# EasyEDA Pro project triple-J UAV 原理图+PCB.epro, board PCB2
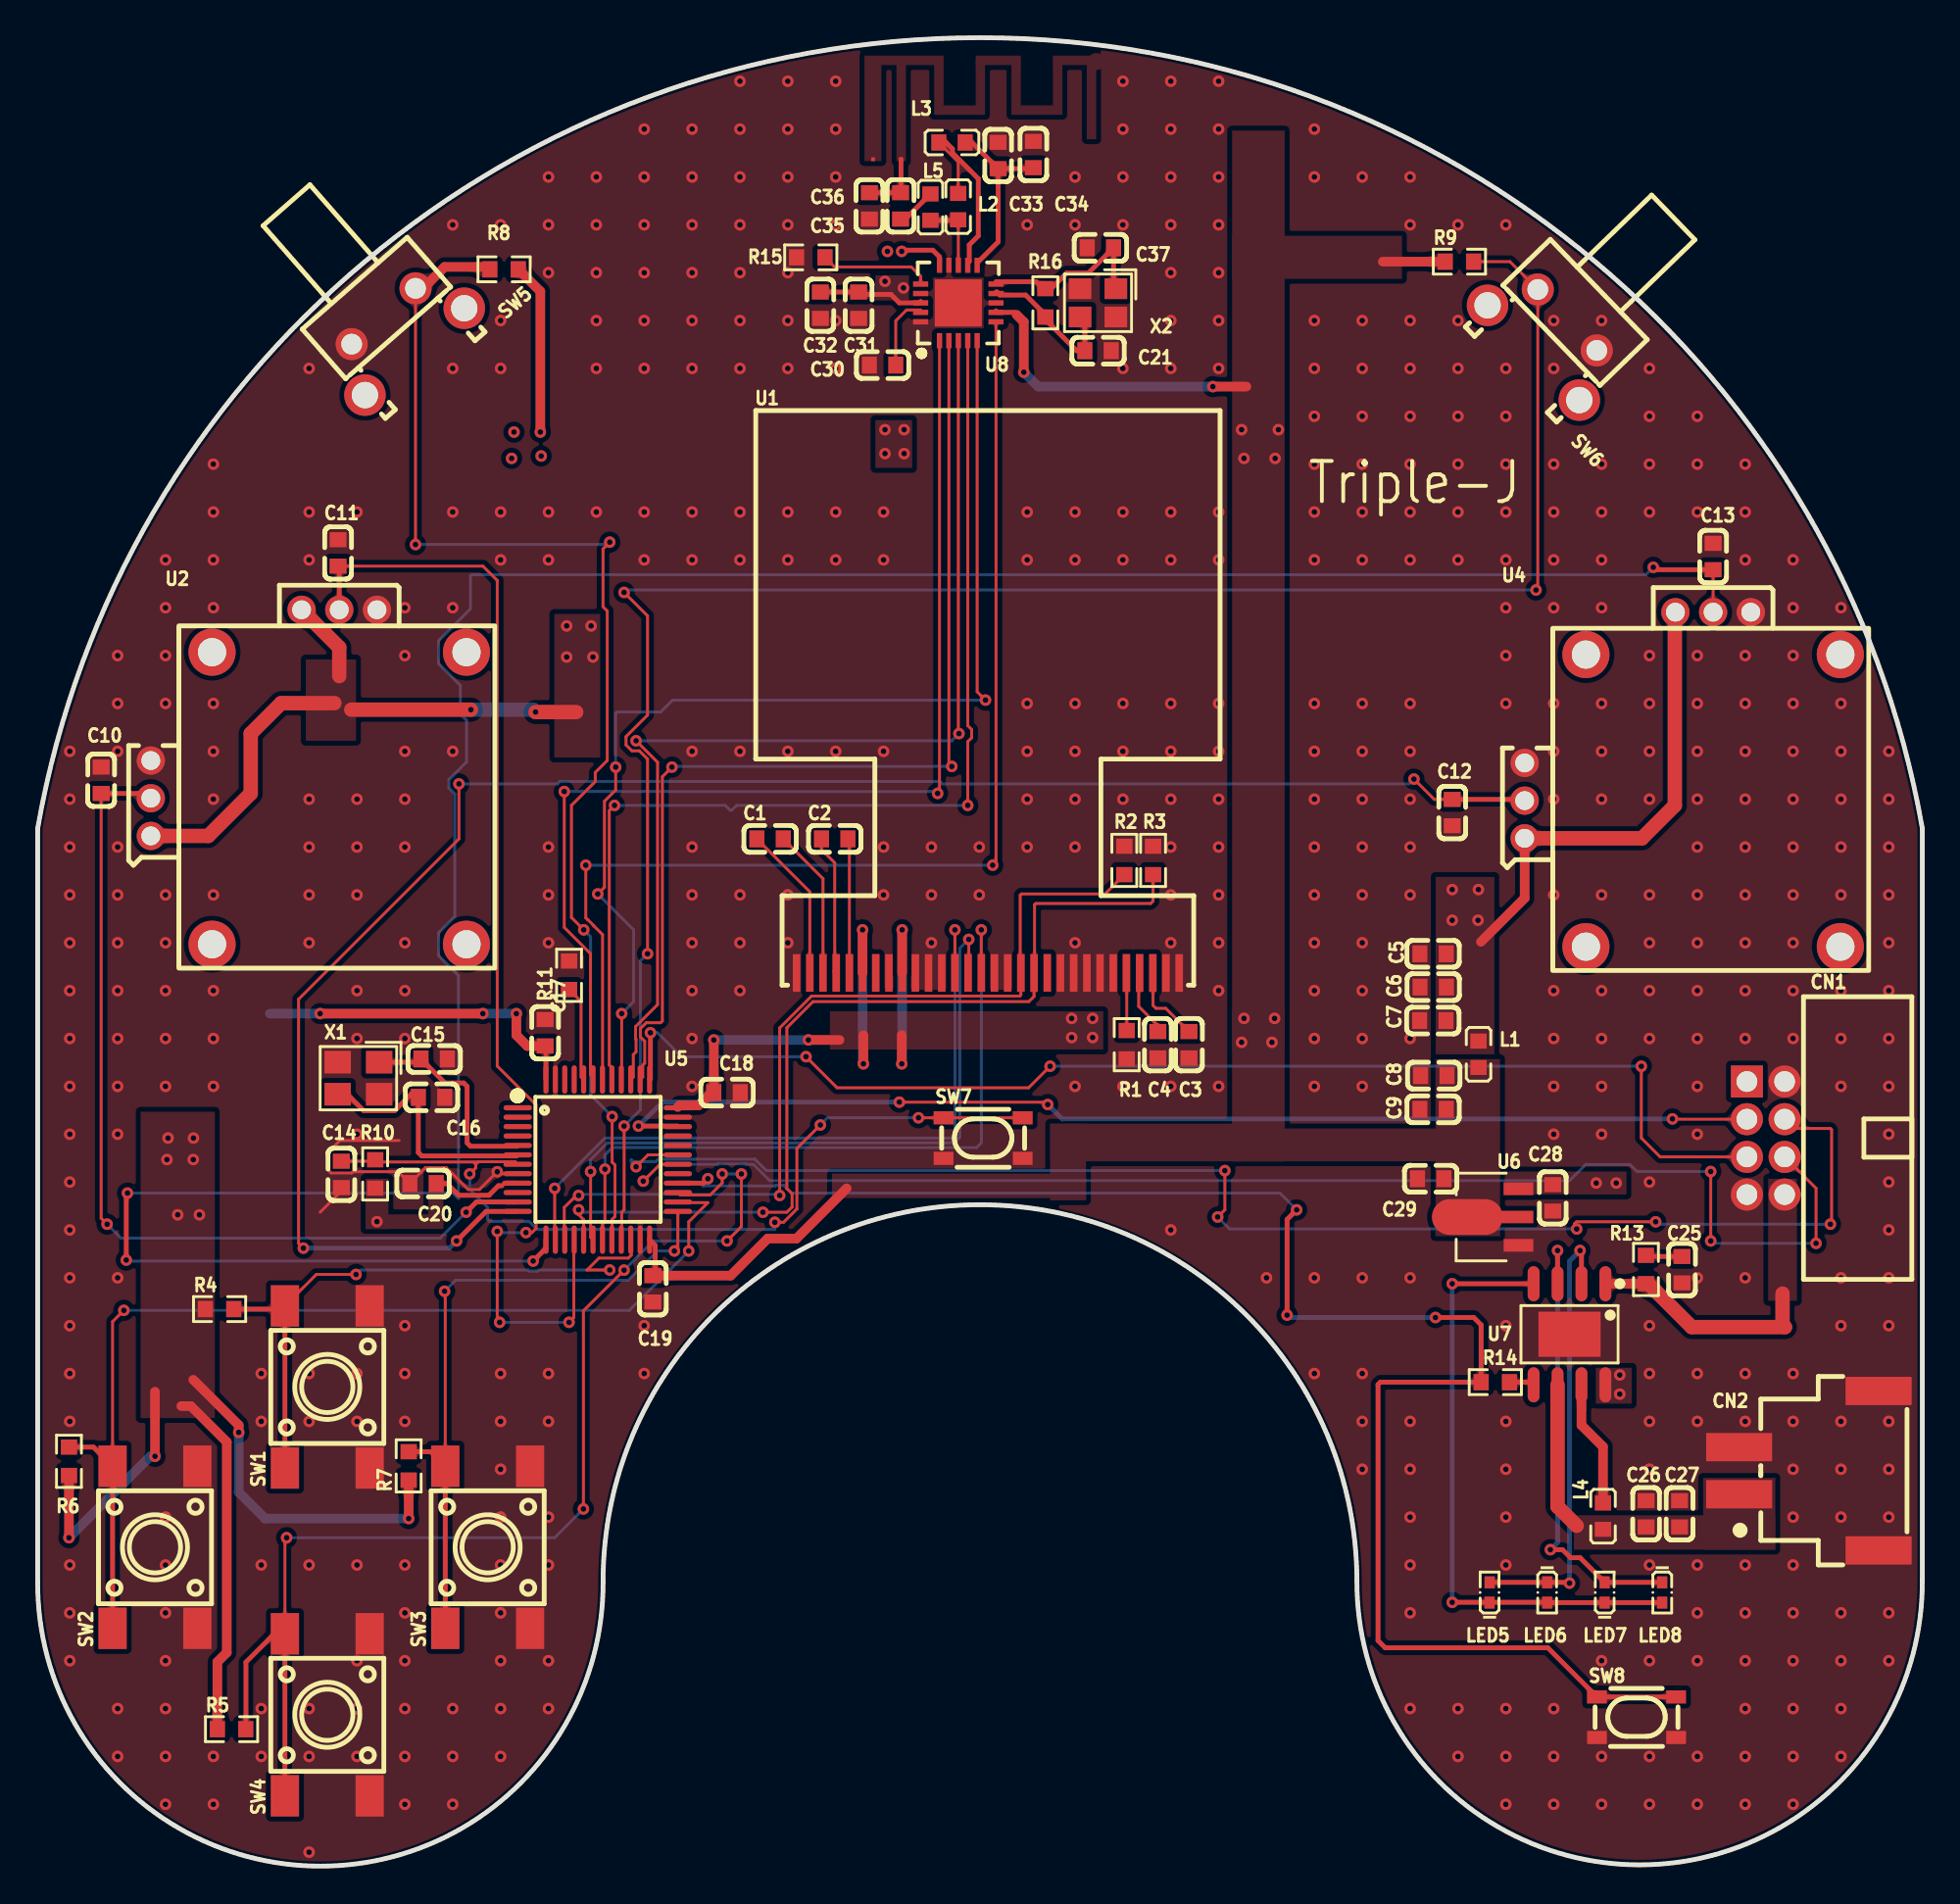
[diagram p11: board, top side]
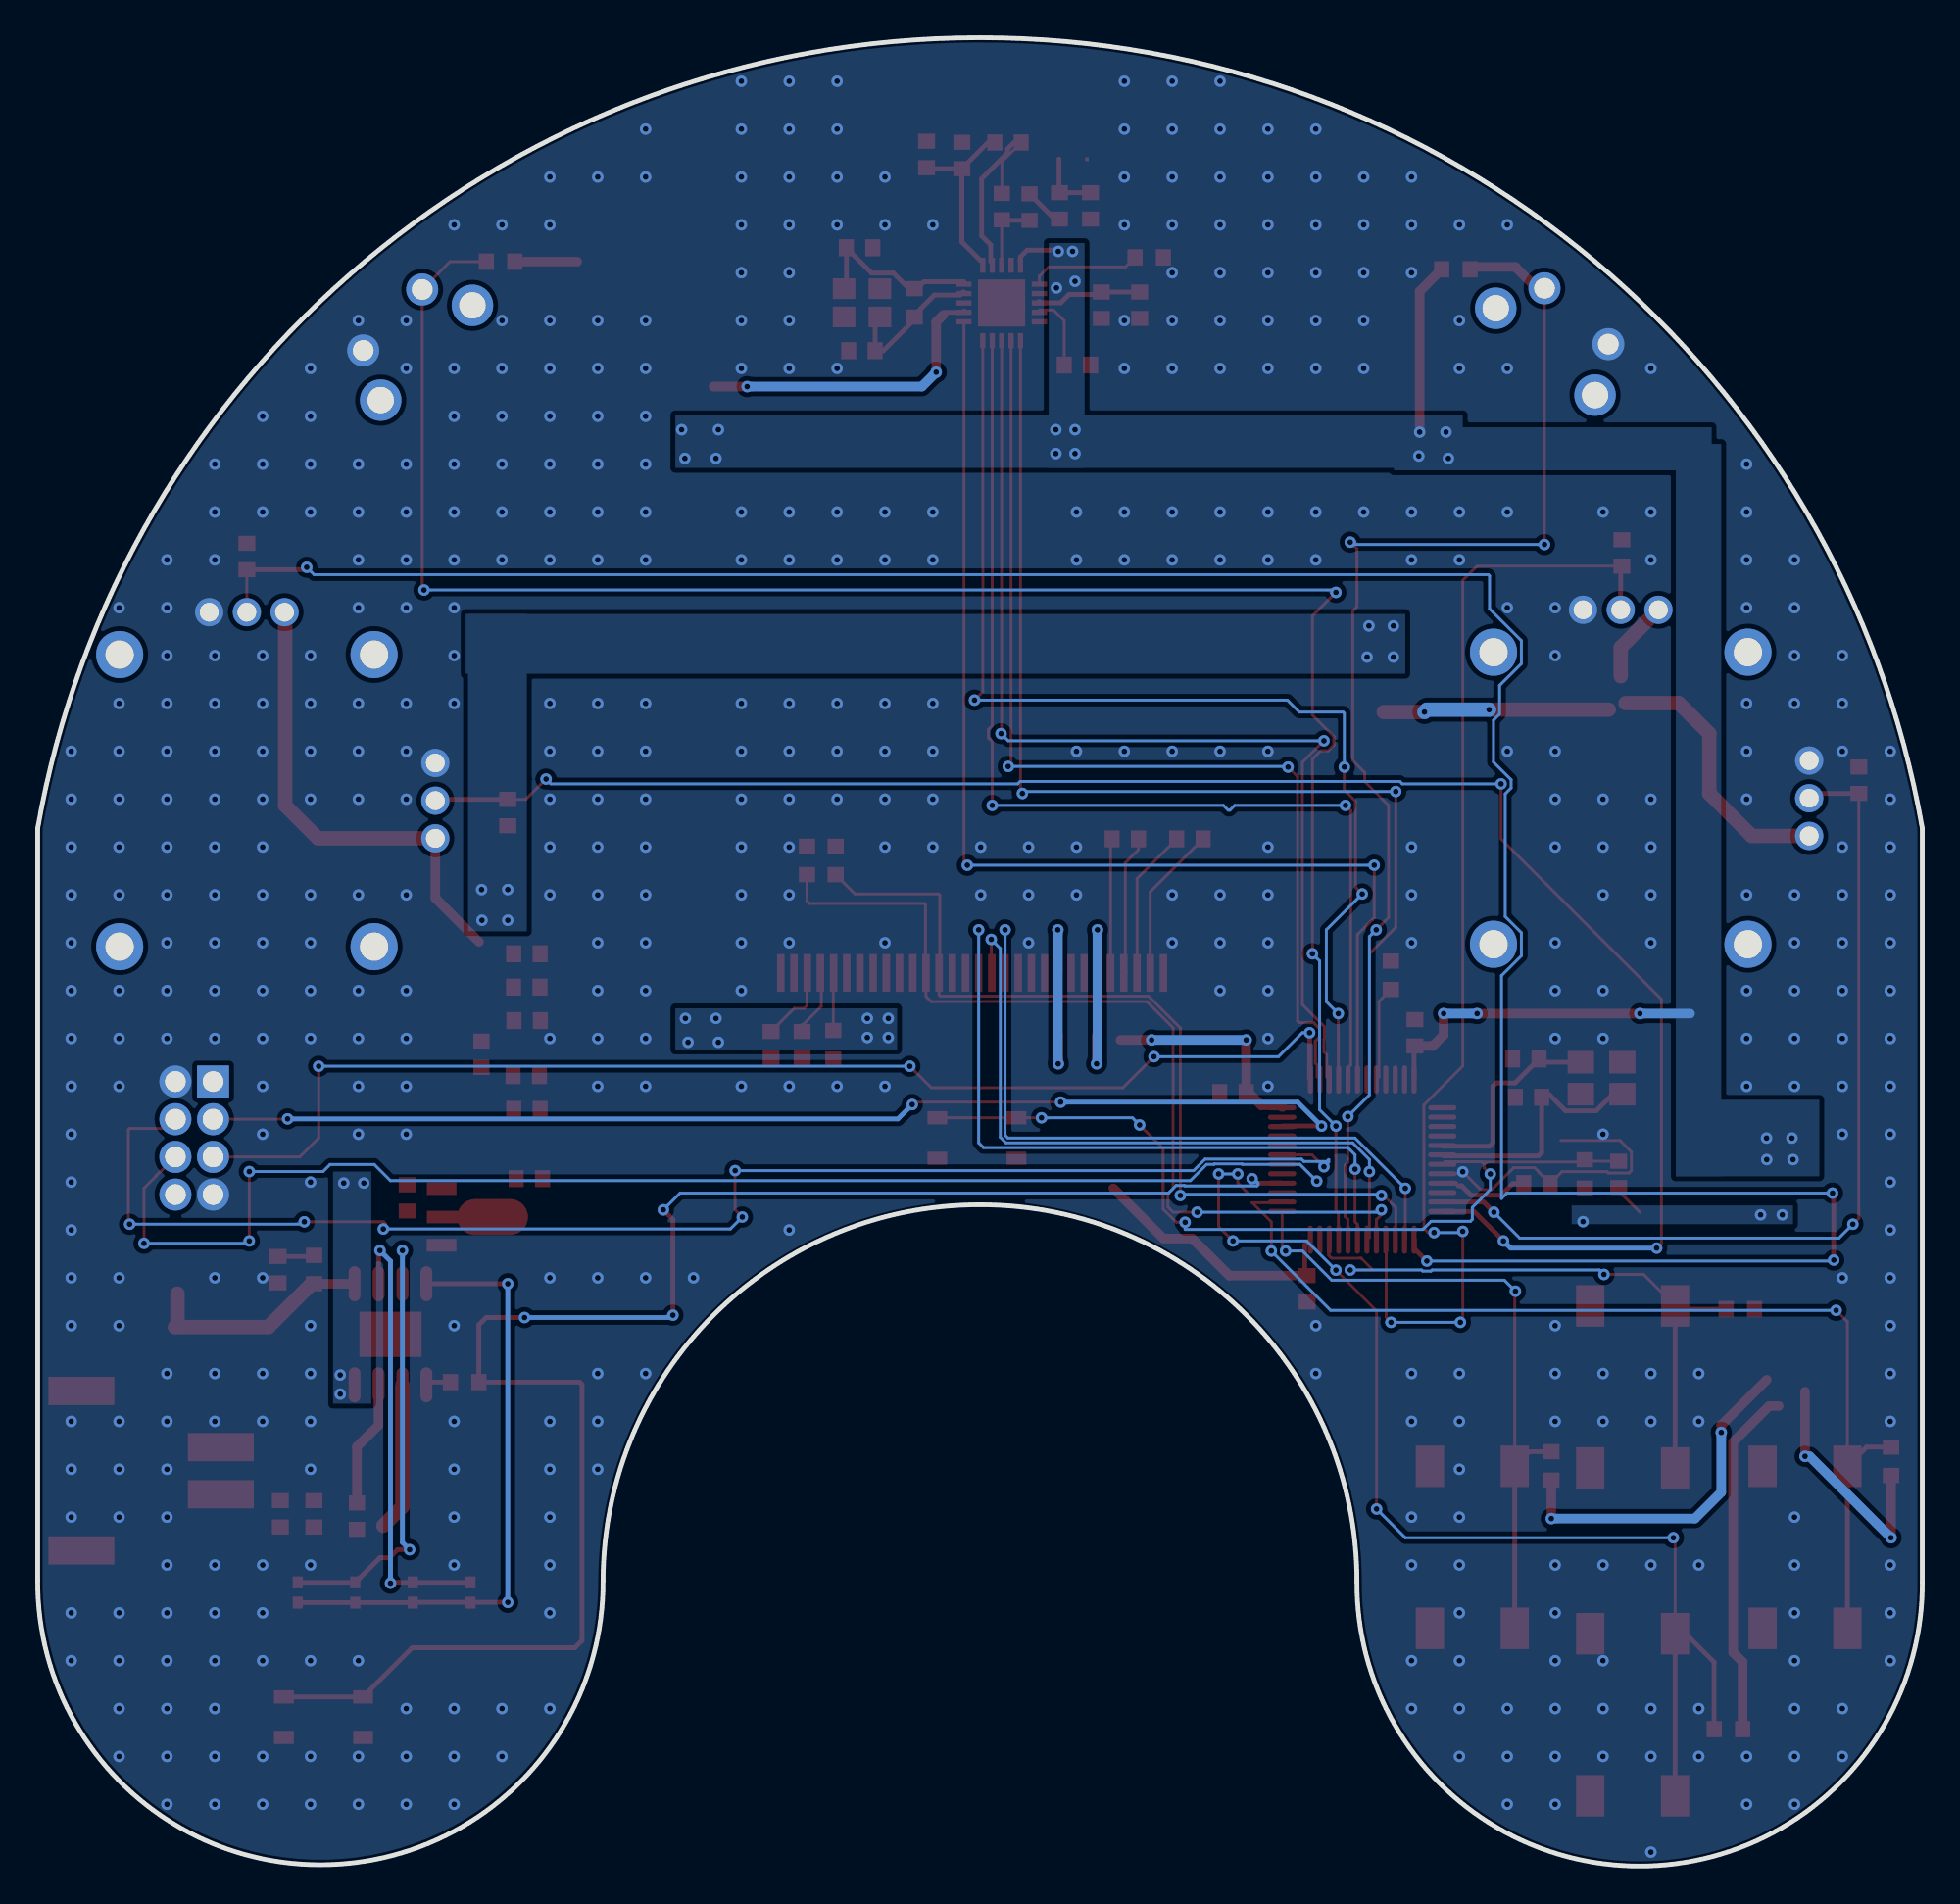
[diagram p12: board, bottom side, seen from below]

Outline 100 x 97.04 mm; copper layers: Top Layer, Bottom Layer. Coordinates in mm from the lower left corner of the outline.
Outline path: 0,55.09 0,15.09 arc(15,0) 30,15.09 arc(50,35.09) 70,15.13 arc(85,0.09) 100,15.17 100,55.09 arc(50,97.04) 0,55.09
Stack: Top Layer 0.035mm / Dielectric1 1.51mm FR4 er 4.5 / Bottom Layer 0.035mm

## Design rules (mm)
template: 自定义配置
spacing copperThickness1oz (default): track to track 0.102, other pairs 0.152 to 0.3
spacing copperThickness2oz: track to track 0.203, other pairs 0.152 to 0.3
track width copperThickness1oz (default): min 0.127, default 0.152, max 2.54
track width copperThickness2oz: min 0.203, default 0.254, max 2.54
differential pair differentialPair (default): width min 0.127, default 0.254, max 2.54; gap min 0.152, default 0.152
via viaSize (default): diameter min 0.5, default 0.61, max 10; hole min 0.3, default 0.305, max 6.3

## Placement (name value [footprint] x y rotation side)
C1  1uF  [C0603]  38.86 54.52 0 top
C2  1uF  [C0603]  42.29 54.52 0 top
C3  2.2uF  [C0603]  61.09 43.6 90 top
C4  4.7uF  [C0603]  59.44 43.6 90 top
C5  10uF  [C0603]  74.04 48.43 0 top
C6  100nF  [C0603]  74.05 46.66 0 top
C7  1nF  [C0603]  74.03 44.88 0 top
C8  100nF  [C0603]  74.08 41.96 0 top
C9  10uF  [C0603]  74.04 40.17 0 top
C10  100nF  [C0603]  3.37 57.64 270 top
C11  100nF  [C0603]  15.94 69.7 90 top
C12  100nF  [C0603]  75.06 55.92 90 top
C13  100nF  [C0603]  88.9 69.51 90 top
C14  100nF  [C0603]  16.11 36.72 90 top
C15  12pF  [C0603]  21.04 42.84 0 top
C16  12pF  [C0603]  20.9 40.81 180 top
C17  100nF  [C0603]  26.92 44.24 270 top
C18  100nF  [C0603]  36.58 41.06 180 top
C19  100nF  [C0603]  32.64 30.65 90 top
C20  100nF  [C0603]  20.45 36.23 0 top
C21  100nF  [C0603]  56.26 80.43 180 top
C25  2.2uF  [C0603]  87.25 31.66 270 top
C26  10uF  [C0603]  85.34 18.71 270 top
C27  10uF  [C0603]  87.12 18.71 270 top
C28  10uF  [C0603]  80.39 35.47 90 top
C29  10uF  [C0603]  73.91 36.49 180 top
C30  33nF  [C0603]  44.83 79.67 0 top
C31  100nF  [C0603]  43.56 82.84 90 top
C32  10nF  [C0603]  41.53 82.84 90 top
C33  2.2nF  [C0603]  50.96 90.79 270 top
C34  4.7pF  [C0603]  52.83 90.84 270 top
C35  1.5pF  [C0603]  45.78 88.12 270 top
C36  1pF  [C0603]  44.13 88.12 270 top
C37  100nF  [C0603]  56.39 85.89 180 top
CN1  3111-08RG0BK00T1  [CONN-TH_3111-08RG0BK00T1]  91.69 38.65 270 top
CN2  ZX-XH2.54-2PWT  [CONN-SMD_2P-P2.54_MEGASTAR_ZX-XH2.54-2PWT]  93.98 20.99 90 top
L1  10uH  [L0603]  76.45 43.09 270 top
L2  8.2nH  [L0603]  48.84 88.08 270 top
L3  2.7nH  [L0603]  48.51 91.48 0 top
L4  1.5uH  [L0603]  83.06 18.58 270 top
L5  3.9nH  [L0603]  47.37 88.05 90 top
LED5  XL-1005UYC  [LED0402-FD_YELLOW]  77.04 14.53 270 top
LED6  XL-1005UYC  [LED0402-FD_YELLOW]  80.09 14.53 90 top
LED7  XL-1005UYC  [LED0402-FD_YELLOW]  83.15 14.53 270 top
LED8  XL-1005UYC  [LED0402-FD_YELLOW]  86.2 14.53 90 top
NOREF  -  [Pad_e295]  45.81 90.59 90 top
NOREF#2  -  [Pad_e296]  44.33 90.59 90 top
R1  910  [R0603]  57.78 43.6 90 top
R2  10K  [R0603]  57.66 53.38 270 top
R3  10K  [R0603]  59.18 53.38 270 top
R4  10K  [R0603]  9.65 29.57 0 top
R5  10K  [R0603]  10.29 7.28 0 top
R6  10K  [R0603]  1.66 21.49 90 top
R7  10K  [R0603]  19.69 21.25 90 top
R8  10K  [R0603]  24.75 84.75 180 top
R9  10K  [R0603]  75.44 85.16 0 top
R10  10K  [R0603]  17.91 36.74 270 top
R11  10K  [R0603]  28.19 47.28 90 top
R13  1.5  [R0603]  85.34 31.67 90 top
R14  10K  [R0603]  77.34 25.69 180 top
R15  10K  [R0603]  41.02 85.38 180 top
R16  10K  [R0603]  53.47 82.97 90 top
SW1  TS-1102S-C-M-B  [KEY-SMD_4P-L6.0-W6.0-P4.50-LS8.6_TS-1102S-C-M-B]  15.37 25.44 90 top
SW2  TS-1102S-C-M-B  [KEY-SMD_4P-L6.0-W6.0-P4.50-LS8.6_TS-1102S-C-M-B]  6.22 16.93 90 top
SW3  TS-1102S-C-M-B  [KEY-SMD_4P-L6.0-W6.0-P4.50-LS8.6_TS-1102S-C-M-B]  23.88 16.93 90 top
SW4  TS-1102S-C-M-B  [KEY-SMD_4P-L6.0-W6.0-P4.50-LS8.6_TS-1102S-C-M-B]  15.37 8.04 90 top
SW5  UK-B02124G90-AQ25Y  [SW-TH_UK-B02124G90-AQ25Y]  19.18 81.32 221.2 top
SW6  UK-B02124G90-AQ25Y  [SW-TH_UK-B02124G90-AQ25Y]  80.26 81.19 134.1 top
SW7  SKRPACE010  [KEY-SMD_4P-L4.2-W3.2-P2.20-LS4.6]  50.16 38.65 0 top
SW8  SKRPACE010  [KEY-SMD_4P-L4.2-W3.2-P2.20-LS4.6]  84.84 7.91 0 top
U1  X096-2864KSWPG01-H30  [OLED-SMD_X096-2864KSWPG01-H30]  50.42 47.41 0 top
U2  -  [1616]  16 56.68 0 top
U4  -  [1616]  88.9 56.55 0 top
U5  STM32F103C8T6  [LQFP-48_L7.0-W7.0-P0.50-LS9.0-BL]  29.72 37.5 270 top
U6  AMS1117-3.3VSOT-89  [SOT-89-3_L4.5-W2.5-P1.50-LS4.2-BR]  77.22 34.46 0 top
U7  TP4336  [ESOP-8_L4.9-W3.9-P1.27-LS6.0-BL-EP-1]  81.28 28.23 180 top
U8  Si24R1  [QFN-20_L4.0-W4.0-P0.50-BL-EP]  48.85 82.96 0 top
X1  8MHz  [CRYSTAL-SMD_4P-L3.2-W2.5-BL]  17.02 41.82 180 top
X2  16MHz  [CRYSTAL-SMD_4P-L2.5-W2.0-BL-2]  56.26 82.97 180 top

## Footprints (pads in the part's own frame, mm; a bottom-side part is the same pattern mirrored in y, then rotated)
1616
  round 1.5 hole 1: 1(-10,2) 2(-10,0) 3(-10,-2.001) 4(-2,10) 5(0,10) 6(2,10)
  round 2.5 hole 1.5: 7(-6.75,-7.75) 8(6.75,-7.75) 9(6.75,7.75) 10(-6.75,7.75)
C0603
  rect 0.8x0.9 smd: 1(-0.7,0) 2(0.7,0)
CONN-SMD_2P-P2.54_MEGASTAR_ZX-XH2.54-2PWT
  rect 1.5x3.5 smd: 1(-1.25,3.7) 2(1.25,3.7) 3(-4.23,-3.7) 4(4.23,-3.7)
CONN-TH_3111-08RG0BK00T1
  rect 1.7x1.7 hole 1.1: 1(-3,-1)
  round 1.7 hole 1.1: 2(-3,1) 3(-1,-1) 4(-1,1) 5(1,-1) 6(1,1) 7(3,-1) 8(3,1)
CRYSTAL-SMD_4P-L2.5-W2.0-BL-2
  rect 1.2x1.1 smd: 1(-0.95,-0.75) 2(0.95,-0.75) 3(0.95,0.75) 4(-0.95,0.75)
CRYSTAL-SMD_4P-L3.2-W2.5-BL
  rect 1.4x1.2 smd: 1(-1.1,-0.85) 2(1.1,-0.85) 3(1.1,0.85) 4(-1.1,0.85)
ESOP-8_L4.9-W3.9-P1.27-LS6.0-BL-EP-1
  oval 0.63x1.865 smd: 1(-1.905,-2.683) 2(-0.635,-2.683) 3(0.635,-2.683) 4(1.905,-2.683) 5(1.905,2.683) 6(0.635,2.683) 7(-0.635,2.683) 8(-1.905,2.683)
  rect 3.3x2.4 smd: 9(0,0)
KEY-SMD_4P-L4.2-W3.2-P2.20-LS4.6
  rect 1.05x0.7 smd: 1(-2.1,1.075) 2(2.1,1.075) 3(-2.1,-1.075) 4(2.1,-1.075)
KEY-SMD_4P-L6.0-W6.0-P4.50-LS8.6_TS-1102S-C-M-B
  rect 2.2x1.5 smd: 1(-4.3,2.25) 2(4.3,2.25) 3(-4.3,-2.25) 4(4.3,-2.25)
L0603
  rect 0.8x0.864 smd: 1(-0.7,0) 2(0.7,0)
LED0402-FD_YELLOW
  rect 0.636x0.54 smd: 1(-0.538,0) 2(0.538,0)
LQFP-48_L7.0-W7.0-P0.50-LS9.0-BL
  oval 0.27x1.5 smd: 1(-2.75,-4.25) 2(-2.25,-4.25) 3(-1.75,-4.25) 4(-1.25,-4.25) 5(-0.75,-4.25) 6(-0.25,-4.25) 7(0.25,-4.25) 8(0.75,-4.25) 9(1.25,-4.25) 10(1.75,-4.25) 11(2.25,-4.25) 12(2.75,-4.25) 25(2.75,4.25) 26(2.25,4.25) 27(1.75,4.25) 28(1.25,4.25) 29(0.75,4.25) 30(0.25,4.25) 31(-0.25,4.25) 32(-0.75,4.25) 33(-1.25,4.25) 34(-1.75,4.25) 35(-2.25,4.25) 36(-2.75,4.25)
  oval 1.5x0.27 smd: 13(4.25,-2.75) 14(4.25,-2.25) 15(4.25,-1.75) 16(4.25,-1.25) 17(4.25,-0.75) 18(4.25,-0.25) 19(4.25,0.25) 20(4.25,0.75) 21(4.25,1.25) 22(4.25,1.75) 23(4.25,2.25) 24(4.25,2.75) 37(-4.25,2.75) 38(-4.25,2.25) 39(-4.25,1.75) 40(-4.25,1.25) 41(-4.25,0.75) 42(-4.25,0.25) 43(-4.25,-0.25) 44(-4.25,-0.75) 45(-4.25,-1.25) 46(-4.25,-1.75) 47(-4.25,-2.25) 48(-4.25,-2.75)
OLED-SMD_X096-2864KSWPG01-H30
  rect 0.4x2 smd: 1(-10.15,0) 2(-9.45,0) 3(-8.75,0) 4(-8.05,0) 5(-7.35,0) 6(-6.65,0) 7(-5.95,0) 8(-5.25,0) 9(-4.55,0) 10(-3.85,0) 11(-3.15,0) 12(-2.45,0) 13(-1.75,0) 14(-1.05,0) 15(-0.35,0) 16(0.35,0) 17(1.05,0) 18(1.75,0) 19(2.45,0) 20(3.15,0) 21(3.85,0) 22(4.55,0) 23(5.25,0) 24(5.95,0) 25(6.65,0) 26(7.35,0) 27(8.05,0) 28(8.75,0) 29(9.45,0) 30(10.15,0)
Pad_e295
  rect 0.2x0.2 smd: 1(0,0)
Pad_e296
  rect 0.2x0.2 smd: 2(0,0)
QFN-20_L4.0-W4.0-P0.50-BL-EP
  rect 0.28x0.8 smd: 1(-1,-2) 2(-0.5,-2) 3(0,-2) 4(0.5,-2) 5(1,-2) 11(1,2) 12(0.5,2) 13(0,2) 14(-0.5,2) 15(-1,2)
  rect 0.8x0.28 smd: 6(2,-1) 7(2,-0.5) 8(2,0) 9(2,0.5) 10(2,1) 16(-2,1) 17(-2,0.5) 18(-2,0) 19(-2,-0.5) 20(-2,-1)
  rect 2.5x2.5 smd: 21(0,0)
R0603
  rect 0.806x0.864 smd: 1(-0.753,0) 2(0.753,0)
SOT-89-3_L4.5-W2.5-P1.50-LS4.2-BR
  rect 1.575x0.672 smd: 1(1.356,-1.5) 3(1.356,1.5)
  custom 5.377x1.9 smd: 2(-1.356,0)
SW-TH_UK-B02124G90-AQ25Y
  round 1.7 hole 1.1: 1(-2.25,-1.25) 2(2.25,-1.25)
  round 2.2 hole 1.4: 3(-3.5,1.25) 4(3.5,1.25)

## Nets
As in the schematic, except:
AT1: C35.1 C36.1 NOREF.1 NOREF#2.2
$4N1175: R11.1 U5.44

Pads without a net: CN1 1; SW5 3 4; SW6 3 4; U1 7 20; U2 7 8 9 10; U4 7 8 9 10; U5 1 2 3 4 10 29 32 33 45 46

## Via types
v1: diameter 0.61, hole 0.305, Top Layer to Bottom Layer, 673 vias

## Routing (per net, layer and track width the routed paths; a pad name or vN(x,y) marks a point on that pad's centre or on a via; arc(x,y) is an arc through that point)
3V3: length 157.5
  Top Layer w0.254: 32.77,31.47 32.77,32.96 U5.24 ; C20.2 21.72,36.23 22.34,35.61 23.94,35.61 24.45,36.12 24.63,36.12 ; 47.85,85.09 47.85,85.41 47.5,85.76 45.91,85.76 v1(45.84,85.7) ; 46.85,83.05 46.77,82.97 45.72,82.97 45.27,83.42 43.69,83.42 43.56,83.54 41.53,83.54 ; U5.9 24.77,36.25 ; 51.94,82.34 51.81,82.47 50.93,82.47 50.85,82.55 ; U5.48 26.97,43.49 C17.2
  Top Layer w0.508: 8.25,25.82 10.67,23.41 v1(10.67,23.03) ; R5.1 9.53,10.84 10.03,11.34 10.03,22.52 8.13,24.42 7.62,24.42 ; R6.1 v1(1.66,17.44) ; v1(52.32,79.29) 52.32,81.95 51.94,82.34 ; v1(45.85,42.58) 45.85,44.11 ; R9.1 71.37,85.16 ; v1(25.4,45.25) 25.4,44.11 25.97,43.54 C17.2 ; v1(40.89,43.85) 42.54,43.85 ; U1.9 v1(45.87,49.7) ; R7.1 v1(19.69,18.45) ; R8.1 26.67,83.58 v1(26.67,76.11) ; U1.6 v1(43.77,49.7) ; v1(35.88,43.85) C18.2 35.75,41.06 35.07,40.38 34.05,40.38 33.97,40.3 ; v1(43.81,42.58) 43.81,44.11 ; 42.93,35.98 40.26,33.31 38.74,33.31 36.77,31.35 C19.2 ; v1(6.22,21.76) 6.22,25.19 ; v1(23.62,45.25) v1(14.99,45.25) ; v1(62.36,78.53) 64.13,78.53
  Bottom Layer w0.508: v1(25.4,45.25) v1(23.62,45.25) ; v1(1.66,17.44) 5.98,21.76 v1(6.22,21.76) ; v1(35.88,43.85) v1(40.89,43.85) ; v1(45.87,49.7) 45.87,42.61 v1(45.85,42.58) ; v1(52.32,79.29) 53.09,78.53 v1(62.36,78.53) ; v1(43.77,49.7) 43.77,42.63 v1(43.81,42.58) ; v1(14.99,45.25) 12.32,45.25 ; v1(10.67,23.03) 10.67,19.85 12.06,18.45 v1(19.69,18.45)
  vias: v1(6.92,38.65) v1(6.86,37.5) v1(7.43,34.57) v1(8.26,38.65) v1(8.25,37.5) v1(8.58,34.57) v1(18,34.21) v1(25.15,74.72) v1(25.27,76.11) v1(26.72,74.84) v1(44.96,84.11) v1(44.96,76.24) v1(44.96,74.97) v1(45.09,85.7) v1(45.94,83.76) v1(45.97,76.24) v1(45.97,74.97) v1(54.86,45) v1(54.86,43.98) v1(55.98,45) v1(55.98,43.98) v1(63.88,76.24) v1(63.88,43.73) v1(64.01,74.72) v1(64.01,45) v1(65.49,43.73) v1(65.63,45) v1(65.66,74.72) v1(65.83,76.24)
3V3A: length 56.3
  Top Layer w0.508: U4.3 78.9,51.38 76.58,49.06
  Top Layer w0.762: 16,63.16 16,64.68 U2.4 ; 15.75,61.73 12.92,61.73 11.3,60.11 11.3,56.94 9.05,54.68 U2.3 ; U4.3 85.12,54.55 86.87,56.3 86.87,66.52 U4.4 ; 16.64,61.38 v1(22.99,61.38) ; v1(26.42,61.25) 28.57,61.25
  Bottom Layer w0.762: v1(22.99,61.38) 26.29,61.38 v1(26.42,61.25)
  vias: v1(28.07,65.83) v1(28.07,64.17) v1(29.36,65.83) v1(29.46,64.17) v1(75.06,51.83) v1(75.06,50.2) v1(76.45,51.83) v1(76.42,50.2)
+5V:
  vias: v1(82.7,36.26) v1(83.76,36.26) v1(83.95,26.07) v1(83.95,25.06)
GND: length 18.4
  Top Layer w0.152: 19.18,38.52 16.04,38.52 15.43,37.91 15.43,36.92 15.57,36.79 16.66,36.79 16.73,36.86 19.12,36.86 C20.1 20.35,36.84 20.35,36.85 20.57,37.07 21.68,37.07 22.84,35.92 23.44,35.92 v1(24.38,36.86) 24.49,36.75 U5.8 ; C14.1 16.11,35.84 14.99,34.71
  vias: v1(1.7,59.17) v1(1.7,56.63) v1(1.7,54.09) v1(1.7,51.55) v1(1.7,49.01) v1(1.7,46.47) v1(1.7,43.93) v1(1.7,41.39) v1(1.7,38.85) v1(1.7,36.31) v1(1.7,33.77) v1(1.7,31.23) v1(1.7,28.69) v1(1.7,26.15) v1(1.7,23.61) v1(1.7,15.99) v1(1.7,13.45) v1(1.7,10.91) v1(4.24,64.25) v1(4.24,61.71) v1(4.24,59.17) v1(4.24,54.09) v1(4.24,51.55) v1(4.24,49.01) v1(4.24,46.47) v1(4.24,43.93) v1(4.24,41.39) v1(4.24,38.85) v1(4.24,31.23) v1(4.24,8.37) v1(4.24,5.83) v1(6.78,69.33) v1(6.78,66.79) v1(6.78,64.25) v1(6.78,61.71) v1(6.78,51.55) v1(6.78,49.01) v1(6.78,46.47) v1(6.78,43.93) v1(6.78,41.39) v1(6.78,18.53) v1(6.78,15.99) v1(6.78,13.45) v1(6.78,10.91) v1(6.78,8.37) v1(6.78,5.83) v1(6.78,3.29) v1(9.32,74.41) v1(9.32,71.87) v1(9.32,69.33) v1(9.32,66.79) v1(9.32,61.71) v1(9.32,59.17) v1(9.32,56.63) v1(9.32,51.55) v1(9.32,46.47) v1(9.32,43.93) v1(9.32,41.39) v1(9.32,5.83) v1(9.32,3.29) v1(11.86,26.15) v1(11.86,23.61) v1(11.86,15.99) v1(11.86,8.37) v1(11.86,5.83) v1(14.4,79.49) v1(14.4,71.87) v1(14.4,69.33) v1(14.4,56.63) v1(14.4,54.09) v1(14.4,51.55) v1(14.4,49.01) v1(14.4,26.15) v1(14.4,23.61) v1(14.4,15.99) v1(14.4,8.37) v1(14.4,5.83) v1(14.4,0.75) v1(16.94,71.87) v1(16.94,56.63) v1(16.94,54.09) v1(16.94,51.55) v1(16.94,46.47) v1(16.94,43.93) v1(16.94,38.85) v1(16.94,26.15) v1(16.94,23.61) v1(16.94,15.99) v1(16.94,10.91) v1(16.94,8.37) v1(16.94,5.83) v1(19.48,66.79) v1(19.48,64.25) v1(19.48,59.17) v1(19.48,56.63) v1(19.48,54.09) v1(19.48,49.01) v1(19.48,46.47) v1(19.48,43.93) v1(19.48,28.69) v1(19.48,26.15) v1(19.48,23.61) v1(19.48,15.99) v1(19.48,13.45) v1(19.48,10.91) v1(19.48,8.37) v1(19.48,5.83) v1(19.48,3.29) v1(22.02,87.11) v1(22.02,79.49) v1(22.02,71.87) v1(22.02,66.79) v1(22.02,59.17) v1(22.02,8.37) v1(22.02,5.83) v1(22.02,3.29) v1(24.56,87.11) v1(24.56,82.03) v1(24.56,79.49) v1(24.56,71.87) v1(24.56,69.33) v1(24.56,26.15) v1(24.56,23.61) v1(24.56,21.07) v1(24.56,18.53) v1(24.56,15.99) v1(24.56,13.45) v1(24.56,10.91) v1(24.56,8.37) v1(24.56,5.83) v1(27.1,89.65) v1(27.1,87.11) v1(27.1,84.57) v1(27.1,71.87) v1(27.1,69.33) v1(27.1,54.09) v1(27.1,51.55) v1(27.1,49.01) v1(27.1,26.15) v1(27.1,23.61) v1(27.1,18.53) v1(27.1,15.99) v1(27.1,10.91) v1(27.1,8.37) v1(29.64,89.65) v1(29.64,87.11) v1(29.64,84.57) v1(29.64,82.03) v1(29.64,79.49) v1(29.64,71.87) v1(32.18,92.19) v1(32.18,89.65) v1(32.18,87.11) v1(32.18,84.57) v1(32.18,82.03) v1(32.18,79.49) v1(32.18,71.87) v1(32.18,69.33) v1(32.18,28.69) v1(32.18,26.15) v1(34.72,92.19) v1(34.72,89.65) v1(34.72,87.11) v1(34.72,84.57) v1(34.72,82.03) v1(34.72,79.49) v1(34.72,71.87) v1(34.72,69.33) v1(34.72,59.17) v1(34.72,54.09) v1(34.72,51.55) v1(34.72,49.01) v1(34.72,46.47) v1(34.72,43.93) v1(34.72,41.39) v1(37.26,94.73) v1(37.26,92.19) v1(37.26,89.65) v1(37.26,87.11) v1(37.26,84.57) v1(37.26,82.03) v1(37.26,79.49) v1(37.26,71.87) v1(37.26,69.33) v1(37.26,59.17) v1(37.26,51.55) v1(37.26,49.01) v1(37.26,46.47) v1(39.8,94.73) v1(39.8,92.19) v1(39.8,89.65) v1(39.8,87.11) v1(39.8,84.57) v1(39.8,82.03) v1(39.8,79.49) v1(39.8,71.87) v1(39.8,69.33) v1(39.8,59.17) v1(39.8,51.55) v1(39.8,49.01) v1(42.34,94.73) v1(42.34,92.19) v1(42.34,89.65) v1(42.34,87.11) v1(42.34,82.03) v1(42.34,79.49) v1(42.34,71.87) v1(42.34,69.33) v1(42.34,59.17) v1(44.88,71.87) v1(44.88,69.33) v1(44.88,59.17) v1(44.88,54.09) v1(44.88,51.55) v1(47.42,54.09) v1(47.42,51.55) v1(47.42,49.01) v1(49.96,54.09) v1(49.96,51.55) v1(52.5,87.11) v1(52.5,71.87) v1(52.5,69.33) v1(52.5,61.71) v1(52.5,59.17) v1(52.5,56.63) v1(52.5,54.09) v1(55.04,89.65) v1(55.04,87.11) v1(55.04,71.87) v1(55.04,69.33) v1(55.04,61.71) v1(55.04,59.17) v1(55.04,56.63) v1(55.04,54.09) v1(55.04,49.01) v1(55.04,41.39) v1(57.58,94.73) v1(57.58,92.19) v1(57.58,89.65) v1(57.58,87.11) v1(57.58,79.49) v1(57.58,71.87) v1(57.58,69.33) v1(57.58,61.71) v1(57.58,59.17) v1(57.58,56.63) v1(57.58,41.39) v1(60.12,94.73) v1(60.12,92.19) v1(60.12,89.65) v1(60.12,87.11) v1(60.12,84.57) v1(60.12,82.03) v1(60.12,79.49) v1(60.12,71.87) v1(60.12,69.33) v1(60.12,61.71) v1(60.12,59.17) v1(60.12,56.63) v1(60.12,54.09) v1(60.12,51.55) v1(60.12,49.01) v1(60.12,41.39) v1(60.12,33.77) v1(62.66,94.73) v1(62.66,92.19) v1(62.66,89.65) v1(62.66,87.11) v1(62.66,84.57) v1(62.66,82.03) v1(62.66,79.49) v1(62.66,71.87) v1(62.66,69.33) v1(62.66,61.71) v1(62.66,59.17) v1(62.66,56.63) v1(62.66,54.09) v1(62.66,51.55) v1(62.66,49.01) v1(62.66,46.47) v1(62.66,41.39) v1(65.2,31.23) v1(67.74,92.19) v1(67.74,89.65) v1(67.74,82.03) v1(67.74,79.49) v1(67.74,76.95) v1(67.74,74.41) v1(67.74,71.87) v1(67.74,69.33) v1(67.74,61.71) v1(67.74,59.17) v1(67.74,56.63) v1(67.74,54.09) v1(67.74,51.55) v1(67.74,49.01) v1(67.74,46.47) v1(67.74,43.93) v1(67.74,41.39) v1(67.74,31.23) v1(67.74,26.15) v1(70.28,89.65) v1(70.28,82.03) v1(70.28,79.49) v1(70.28,76.95) v1(70.28,74.41) v1(70.28,71.87) v1(70.28,69.33) v1(70.28,61.71) v1(70.28,59.17) v1(70.28,56.63) v1(70.28,54.09) v1(70.28,51.55) v1(70.28,49.01) v1(70.28,46.47) v1(70.28,43.93) v1(70.28,41.39) v1(70.28,31.23) v1(70.28,26.15) v1(70.28,23.61) v1(70.28,21.07) v1(72.82,89.65) v1(72.82,87.11) v1(72.82,82.03) v1(72.82,79.49) v1(72.82,76.95) v1(72.82,74.41) v1(72.82,71.87) v1(72.82,69.33) v1(72.82,61.71) v1(72.82,59.17) v1(72.82,56.63) v1(72.82,54.09) v1(72.82,51.55) v1(72.82,43.93) v1(72.82,31.23) v1(72.82,23.61) v1(72.82,21.07) v1(72.82,18.53) v1(72.82,15.99) v1(72.82,13.45) v1(72.82,8.37) v1(75.36,87.11) v1(75.36,82.03) v1(75.36,79.49) v1(75.36,76.95) v1(75.36,74.41) v1(75.36,71.87) v1(75.36,69.33) v1(75.36,8.37) v1(75.36,5.83) v1(77.9,87.11) v1(77.9,79.49) v1(77.9,76.95) v1(77.9,74.41) v1(77.9,71.87) v1(77.9,69.33) v1(77.9,66.79) v1(77.9,64.25) v1(77.9,61.71) v1(77.9,28.69) v1(77.9,23.61) v1(77.9,21.07) v1(77.9,18.53) v1(77.9,15.99) v1(77.9,8.37) v1(77.9,5.83) v1(77.9,3.29) v1(80.44,82.03) v1(80.44,79.49) v1(80.44,74.41) v1(80.44,71.87) v1(80.44,69.33) v1(80.44,66.79) v1(80.44,61.71) v1(80.44,59.17) v1(80.44,56.63) v1(80.44,51.55) v1(80.44,46.47) v1(80.44,43.93) v1(80.44,41.39) v1(80.44,38.85) v1(80.44,8.37) v1(80.44,5.83) v1(80.44,3.29) v1(82.98,82.03) v1(82.98,74.41) v1(82.98,71.87) v1(82.98,69.33) v1(82.98,66.79) v1(82.98,61.71) v1(82.98,59.17) v1(82.98,56.63) v1(82.98,51.55) v1(82.98,46.47) v1(82.98,43.93) v1(82.98,41.39) v1(82.98,38.85) v1(82.98,10.91) v1(82.98,5.83) v1(82.98,3.29) v1(85.52,79.49) v1(85.52,76.95) v1(85.52,74.41) v1(85.52,71.87) v1(85.52,64.25) v1(85.52,61.71) v1(85.52,59.17) v1(85.52,56.63) v1(85.52,51.55) v1(85.52,49.01) v1(85.52,46.47) v1(85.52,43.93) v1(85.52,36.31) v1(85.52,28.69) v1(85.52,26.15) v1(85.52,23.61) v1(85.52,21.07) v1(85.52,15.99) v1(85.52,10.91) v1(85.52,5.83) v1(85.52,3.29) v1(88.06,76.95) v1(88.06,74.41) v1(88.06,71.87) v1(88.06,64.25) v1(88.06,61.71) v1(88.06,59.17) v1(88.06,56.63) v1(88.06,54.09) v1(88.06,51.55) v1(88.06,49.01) v1(88.06,46.47) v1(88.06,43.93) v1(88.06,41.39) v1(88.06,38.85) v1(88.06,31.23) v1(88.06,26.15) v1(88.06,23.61) v1(88.06,15.99) v1(88.06,13.45) v1(88.06,10.91) v1(88.06,5.83) v1(88.06,3.29) v1(90.6,74.41) v1(90.6,71.87) v1(90.6,69.33) v1(90.6,64.25) v1(90.6,61.71) v1(90.6,59.17) v1(90.6,56.63) v1(90.6,54.09) v1(90.6,51.55) v1(90.6,49.01) v1(90.6,46.47) v1(90.6,43.93) v1(90.6,31.23) v1(90.6,26.15) v1(90.6,23.61) v1(90.6,15.99) v1(90.6,13.45) v1(90.6,10.91) v1(90.6,8.37) v1(90.6,5.83) v1(90.6,3.29) v1(93.14,69.33) v1(93.14,66.79) v1(93.14,64.25) v1(93.14,61.71) v1(93.14,59.17) v1(93.14,56.63) v1(93.14,54.09) v1(93.14,51.55) v1(93.14,49.01) v1(93.14,46.47) v1(93.14,43.93) v1(93.14,26.15) v1(93.14,23.61) v1(93.14,21.07) v1(93.14,18.53) v1(93.14,15.99) v1(93.14,13.45) v1(93.14,10.91) v1(93.14,8.37) v1(93.14,5.83) v1(93.14,3.29) v1(95.68,66.79) v1(95.68,61.71) v1(95.68,59.17) v1(95.68,56.63) v1(95.68,54.09) v1(95.68,51.55) v1(95.68,46.47) v1(95.68,43.93) v1(95.68,41.39) v1(95.68,31.23) v1(95.68,28.69) v1(95.68,23.61) v1(95.68,21.07) v1(95.68,18.53) v1(95.68,13.45) v1(95.68,10.91) v1(95.68,8.37) v1(95.68,5.83) v1(98.22,59.17) v1(98.22,56.63) v1(98.22,54.09) v1(98.22,51.55) v1(98.22,49.01) v1(98.22,46.47) v1(98.22,43.93) v1(98.22,41.39) v1(98.22,38.85) v1(98.22,36.31) v1(98.22,33.77) v1(98.22,31.23) v1(98.22,28.69) v1(98.22,23.61) v1(98.22,21.07) v1(98.22,18.53) v1(98.22,13.45) v1(98.22,10.91)
VBAT: length 7.9
  Top Layer w0.762: U7.6 80.65,19.09 81.66,18.07
VCC: length 12.3
  Top Layer w0.508: U7.1 85.33,30.92
  Top Layer w0.762: 92.58,30.39 92.58,28.74 92.71,28.61 87.77,28.61 85.46,30.92 R13.1
ADC1-1: length 48.6
  Top Layer w0.152: C10.2 3.37,34.39 v1(3.68,34.08)
  Top Layer w0.254: C10.2 5.75,56.94 U2.2 ; U5.11 23.28,35.25 v1(22.73,34.71)
  Bottom Layer w0.152: v1(22.73,34.71) 21.36,33.34 4.42,33.34 v1(3.68,34.08)
ADC1-2: length 97.7
  Top Layer w0.152: v1(14.1,32.81) 13.84,33.06 13.84,46.01 22.35,54.52 v1(22.35,57.44) ; v1(73.03,57.7) 74.1,56.62 C12.2
  Top Layer w0.254: U4.2 78.84,56.62 C12.2 ; v1(22.22,33.19) 23.79,34.75 U5.12
  Bottom Layer w0.152: v1(73.03,57.7) 72.77,57.44 48,57.44 47.87,57.57 27.72,57.57 27.59,57.44 v1(22.35,57.44)
  Bottom Layer w0.254: v1(22.22,33.19) 21.84,32.81 v1(14.1,32.81)
ADC1-3: length 148.4
  Top Layer w0.152: U4.5 C13.1
  Top Layer w0.254: C13.1 85.85,68.81 v1(85.72,68.94) ; U5.13 26.97,32.8 v1(26.29,32.12) ; v1(4.7,32.17) 4.7,35.66 v1(4.76,35.73)
  Bottom Layer w0.152: v1(26.29,32.12) 4.75,32.12 v1(4.7,32.17) ; v1(85.72,68.94) 85.33,68.54 23.03,68.54 22.96,68.48 22.96,66.73 21.27,65.04 21.27,63.82 22.43,62.67 22.43,61.15 22.76,60.82 22.76,58.6 21.82,57.66 21.82,57.22 22.13,56.91 22.13,50.4 21.27,49.54 21.27,48.32 22.33,47.27 22.33,35.44 22.04,35.73 v1(4.76,35.73)
ADC1-6: length 61.6
  Top Layer w0.152: v1(24.38,33.69) 24.38,29 v1(24.51,28.87) ; C11.1 23.62,69 24.38,68.24 24.38,42.47 26.45,40.41 26.45,33.85 26.22,33.63 v1(25.91,33.63) ; v1(28.19,28.87) 28.45,29.12 28.45,33.23 U5.16
  Top Layer w0.254: U2.5 16,68.94 C11.1
  Bottom Layer w0.152: v1(28.19,28.87) v1(24.51,28.87) ; v1(24.38,33.69) 24.45,33.63 v1(25.91,33.63)
AT1: length 3.4
  Top Layer w0.254: C36.1 C35.1 45.81,88.84 NOREF.1
KEY-DOWN: length 64.1
  Top Layer w0.152: v1(36.32,36.74) 36.32,36.27 35.68,35.63 34.09,35.63 U5.27 ; v1(13.21,17.44) 13.12,17.35 SW4.2 ; v1(36.58,33.19) 37.34,33.95 v1(37.34,36.74) ; v1(28.96,18.96) 28.96,29.48 v1(31.12,31.64)
  Top Layer w0.254: SW4.1 SW4.2 12.56,12.34 11.05,10.83 11.05,7.29 R5.2
  Bottom Layer w0.152: v1(36.58,33.19) 32.66,33.19 v1(31.12,31.64) ; v1(13.21,17.44) 27.43,17.44 v1(28.96,18.96) ; v1(37.34,36.74) v1(36.32,36.74)
KEY-LEFT: length 55.7
  Top Layer w0.152: SW2.2 3.97,28.9 v1(4.57,29.5) ; v1(34.54,32.65) 34.54,34.2 35.56,35.22 34,35.22 U5.26
  Top Layer w0.254: R6.2 2.96,22.25 SW2.2 SW2.1
  Bottom Layer w0.152: v1(34.54,32.65) 31.39,29.5 v1(4.57,29.5)
KEY-LEFT-X: length 67.5
  Top Layer w0.152: SW5.1 v1(20.05,70.14) ; U5.20 30.48,33.27 30.48,34.33 30.63,34.48 30.63,37.22 30.48,37.37 v1(30.48,39.79) ; v1(30.35,70.27) 30,69.91 30,66.84 30.22,66.62 30.22,58.68 29.59,58.05 29.59,57.57 28.32,56.3 28.32,50.35 v1(28.98,49.7)
  Top Layer w0.508: R8.2 23.87,84.88 21.59,84.88 20.46,83.74 SW5.1
  Bottom Layer w0.152: v1(28.98,49.7) 29.34,49.34 29.34,40.93 v1(30.48,39.79) ; v1(20.05,70.14) 30.23,70.14 v1(30.35,70.27)
KEY-RIGHT: length 35.4
  Top Layer w0.152: v1(21.59,30.52) 21.63,30.48 SW3.2 ; v1(33.78,32.65) 33.97,32.84 U5.25
  Top Layer w0.254: R7.2 20.85,22 SW3.2 SW3.1
  Bottom Layer w0.152: v1(33.78,32.65) 32.88,32.65 31.34,31.1 22.17,31.1 v1(21.59,30.52)
KEY-RIGHT-X: length 105.1
  Top Layer w0.152: U5.21 30.99,33.27 30.99,34.71 31.12,34.84 v1(31.12,39.28) ; R9.2 78.12,85.16 SW6.2 79.6,67.83 v1(79.5,67.73) ; v1(31.12,67.6) 32.36,66.36 32.36,61.09 31.22,59.95 31.22,59.51 31.53,59.2 31.92,59.2 32.36,58.76 v1(32.36,48.43)
  Bottom Layer w0.152: v1(79.5,67.73) 31.24,67.73 v1(31.12,67.6) ; v1(32.36,48.43) 31.98,48.05 31.98,40.15 v1(31.12,39.28)
KEY-UP: length 34.2
  Top Layer w0.152: v1(30.35,31.65) 29.15,31.65 29.78,32.28 31.34,32.28 31.5,32.43 31.5,33.25 U5.22 ; SW1.2 14.79,31.41 v1(16.89,31.41)
  Top Layer w0.254: 10.41,29.57 12.95,29.57 SW1.2 SW1.1
  Bottom Layer w0.152: v1(16.89,31.41) 17.13,31.65 26.01,31.65 26.07,31.59 26.51,31.59 26.57,31.65 v1(30.35,31.65)
NRST: length 46.3
  Top Layer w0.152: v1(22.92,36.74) 23.25,37.06 23.25,37.25 ; C14.2 17.74,37.42 17.79,37.37 ; v1(39.12,34.18) 39.58,34.18 40.28,34.88 40.28,38.1 v1(41.53,39.34) ; 23.25,37.25 23.37,37.38 ; 23.25,37.25 23.13,37.37 ; SW7.2 SW7.1 v1(46.74,39.72) ; 23.37,37.38 23.38,37.39 25.33,37.39 U5.7 ; 23.37,37.38 23.38,37.38 ; 23.37,37.38 18.03,37.38 17.92,37.5
  Bottom Layer w0.152: v1(46.74,39.72) 41.91,39.72 v1(41.53,39.34) ; v1(39.12,34.18) 39.12,33.8 26.5,33.8 26.06,34.23 23.98,34.23 23.88,34.33 23.88,34.96 22.92,35.92 v1(22.92,36.74)
OLED-CLK: length 47.2
  Top Layer w0.152: U5.15 27.94,33.28 27.94,34.96 28.57,35.6 v1(28.7,35.6) ; R2.2 56.63,51.6 52.2,51.6 52.13,51.54 52.13,47.45 U1.18 52.17,46.25 52.1,46.18 41.06,46.18 39.37,44.49 v1(39.37,35.6)
  Bottom Layer w0.152: v1(39.37,35.6) 39.33,35.6 39.27,35.66 28.73,35.66 28.7,35.63 v1(28.7,35.6)
OLED-CS: length 38.3
  Top Layer w0.152: U1.13 v1(48.67,49.7) ; U5.14 27.43,33.29 v1(27.43,35.98)
  Bottom Layer w0.152: v1(48.67,49.7) 48.67,38.8 48.52,38.65 30.1,38.65 v1(27.43,35.98)
OLED-D/C: length 38.4
  Top Layer w0.152: v1(30.1,37) 30.1,34.2 29.97,34.07 U5.19 ; 50.07,47.41 v1(50.07,49.7)
  Bottom Layer w0.152: v1(30.1,37) 30.1,37.76 30.48,38.14 49.81,38.14 50.07,38.39 v1(50.07,49.7)
OLED-DIN: length 49.3
  Top Layer w0.152: v1(28.7,34.84) 28.7,34.58 28.97,34.32 U5.17 ; v1(38.48,34.71) 39.75,34.71 40.03,34.99 40.03,35.69 39.75,35.97 39.75,44.5 41.14,45.89 52.59,45.89 52.87,46.17 U1.19 52.89,47.44 52.89,51.03 52.96,51.09 59.06,51.09 59.18,51.22 R3.2
  Bottom Layer w0.152: v1(28.7,34.84) 28.83,34.71 v1(38.48,34.71)
OLED-RES: length 36.9
  Top Layer w0.152: v1(29.34,36.87) 29.34,33.39 U5.18 ; U1.14 49.4,47.44 v1(49.4,49.19)
  Bottom Layer w0.152: v1(29.34,36.87) 29.34,37.5 30.23,38.39 48.62,38.39 48.92,38.69 48.92,48.71 v1(49.4,49.19)
OSC_IN: length 11.1
  Top Layer w0.254: U5.5 25.43,38.21 22.97,38.21 22.79,38.39 22.79,41.39 22.61,41.57 21.61,41.57 C15.1 20.17,42.67 X1.1
OSC_OUT: length 13.4
  Top Layer w0.254: X1.3 16.42,40.97 17.3,40.09 18.93,40.09 19.81,40.97 20.03,40.97 C16.2 20.2,37.88 20.38,37.7 25.41,37.7 U5.6
PA9: length 74.7
  Top Layer w0.152: v1(94.36,33.06) 94.36,35.98 93.72,36.62 93.72,36.64 93.5,36.86 93.48,36.86 CN1.6 ; v1(88.77,33.19) v1(88.77,36.87) ; v1(32.13,36.36) 33.02,37.25 U5.30
  Bottom Layer w0.152: v1(32.13,36.36) 33.02,37.25 36.08,37.25 36.1,37.28 37.56,37.28 37.58,37.25 37.97,37.25 38.84,36.39 81.28,36.39 82.14,37.25 84.48,37.25 84.86,36.87 v1(88.77,36.87) ; v1(94.36,33.06) 88.9,33.06 v1(88.77,33.19)
PA10: length 78.5
  Top Layer w0.152: v1(95.12,34.08) 95.19,34.14 95.19,39.09 95.12,39.16 93.19,39.16 CN1.4 ; v1(81.66,33.82) 81.54,33.94 81.54,34.09 81.65,34.2 v1(85.85,34.2) ; v1(62.61,34.46) 62.99,34.84 v1(62.99,36.92) ; v1(31.75,37.12) 32.38,37.75 U5.31
  Bottom Layer w0.152: v1(81.66,33.82) 63.25,33.82 v1(62.61,34.46) ; v1(31.75,37.12) 31.5,37.38 31.5,37.5 31.6,37.4 32.81,37.4 32.94,37.53 38.05,37.53 38.66,36.92 v1(62.99,36.92) ; v1(85.85,34.2) 85.98,34.08 v1(95.12,34.08)
PA13: length 61.8
  Top Layer w0.152: v1(45.72,40.55) 53.47,40.55 v1(53.59,40.43) ; v1(86.74,39.66) 86.76,39.65 CN1.3
  Top Layer w0.254: v1(31.88,39.28) 33.94,39.28 U5.34
  Bottom Layer w0.254: v1(53.59,40.43) 54.36,39.66 v1(86.74,39.66) ; v1(31.88,39.28) 33.15,40.55 v1(45.72,40.55)
PA14: length 66.6
  Top Layer w0.152: v1(85.09,42.46) 85.09,38.65 86.09,37.65 CN1.5 ; v1(40.77,42.97) 42.42,41.31 52.58,41.31 v1(53.72,42.46)
  Top Layer w0.254: v1(32.51,44.24) 32.51,41.8 U5.37
  Bottom Layer w0.152: v1(85.09,42.46) v1(53.72,42.46) ; v1(40.77,42.97) 34.16,42.97 32.89,44.24 v1(32.51,44.24)
PA15: length 55.4
  Top Layer w0.152: U8.2 48.35,58.52 v1(48.5,58.37) ; v1(33.66,58.33) 33.15,57.82 33.15,44.86 33.05,44.77 32.29,44.77 31.98,44.46 31.98,44.01 32.21,43.79 32.21,42.62 32.1,42.52 32.1,41.89 U5.38
  Bottom Layer w0.152: v1(33.66,58.33) 33.69,58.37 v1(48.5,58.37)
PB3: length 57.2
  Top Layer w0.152: v1(48.88,60.11) 48.85,60.14 U8.3 ; v1(31.75,59.73) 32.89,58.59 32.89,45.73 31.72,44.56 31.72,43.91 31.75,43.88 31.75,43.22 31.6,43.07 31.6,41.89 U5.39
  Bottom Layer w0.152: v1(48.88,60.11) 48.5,59.73 v1(31.75,59.73)
PB4: length 60.1
  Top Layer w0.152: v1(30.67,58.33) 30.67,57.12 30.07,56.52 30.07,51.96 v1(29.72,51.6) ; v1(50.29,61.89) 49.85,62.33 U8.5 ; v1(30.99,45.25) 30.99,41.77 U5.40
  Bottom Layer w0.152: v1(29.72,51.6) 31.62,49.7 31.62,45.89 v1(30.99,45.25) ; v1(30.67,58.33) 30.67,61.19 30.73,61.25 33.05,61.25 33.69,61.89 v1(50.29,61.89)
PB5: length 58.5
  Top Layer w0.152: U8.4 49.35,60.54 49.56,60.33 49.56,59.89 49.35,59.68 v1(49.35,56.3) ; v1(30.61,56.3) 30.33,56.02 30.33,42.52 30.47,42.38 U5.41
  Bottom Layer w0.152: v1(49.35,56.3) 37.08,56.3 36.83,56.05 36.74,56.05 36.48,56.3 v1(30.61,56.3)
PB6: length 62.2
  Top Layer w0.152: v1(50.67,53.13) 50.85,53.3 U8.6 ; v1(29.08,53.13) 29.08,50.33 29.19,50.23 29.2,50.23 29.51,49.92 29.51,49.91 29.97,49.44 29.97,41.76 U5.42
  Bottom Layer w0.152: v1(50.67,53.13) v1(29.08,53.13)
PB7: length 60
  Top Layer w0.152: v1(27.94,57.04) 27.94,49.82 29.33,48.43 29.33,42.02 29.47,41.88 U5.43 ; 47.85,81.09 47.85,57.03 v1(47.75,56.94)
  Bottom Layer w0.152: v1(47.75,56.94) 47.65,57.04 v1(27.94,57.04)
PB15: length 89.8
  Top Layer w0.254: v1(66.8,34.84) 66.29,34.33 v1(66.29,29.25) ; v1(35.56,36.49) 35.33,36.25 U5.28 ; v1(74.17,29.12) 76.2,29.12 76.59,28.73 R14.2 71.25,25.69 71.12,25.57 71.12,11.98 71.5,11.6 80.13,11.6 SW8.1 SW8.2
  Bottom Layer w0.152: v1(35.56,36.49) 35.4,36.33 35.31,36.33 35.24,36.26 35.24,36.17 35.31,36.11 39.12,36.11 39.15,36.13 39.59,36.13 40,35.73 65.91,35.73 v1(66.8,34.84)
  Bottom Layer w0.254: v1(74.17,29.12) 66.42,29.12 v1(66.29,29.25)
XI: length 9.5
  Top Layer w0.254: 50.85,84.09 52.97,84.09 53.34,83.72 53.77,83.72 54.6,84.55 55.75,84.55 C37.1 57.09,83.84 57.21,83.72
XO: length 8
  Top Layer w0.254: 50.85,83.55 50.9,83.55 51.06,83.38 52.42,83.38 53.47,82.34 R16.1 53.47,82.09 55.13,80.43 C21.2 55.56,81.97 X2.3
$1N385: length 8.3
  Top Layer w0.152: 40.97,47.41 40.97,51.72 C1.1
$1N388: length 8
  Top Layer w0.152: C1.2 41.67,52.42 U1.3
$1N423: length 7.4
  Top Layer w0.152: C2.1 41.59,53.95 42.29,53.25 42.29,47.49
  Top Layer w0.254: 42.29,47.49 U1.4
$1N426: length 7.1
  Top Layer w0.152: 43.07,47.41 43.07,54.44 C2.2
$1N808: length 4.2
  Top Layer w0.152: U1.28 59.18,47.4 59.18,45.68 59.33,45.53 59.86,45.53 C3.2
$1N1076: length 3.1
  Top Layer w0.152: U1.26 57.78,47.39 R1.2
$1N1372: length 3.6
  Top Layer w0.152: 58.47,47.41 58.42,47.36 58.42,45.63 59.44,44.62
  Top Layer w0.254: 59.44,44.62 C4.2
$4N1175: length 5.1
  Top Layer w0.152: R11.1 28.83,45.89 28.83,41.89 U5.44
$5N866: length 6.7
  Top Layer w0.508: L4.1 83.06,22.26 81.91,23.41 U7.7
$5N869: length 1.3
  Top Layer w0.254: U7.5 79.23,25.69 R14.1
$5N873: length 23.9
  Top Layer w0.254: 77.04,15.07 LED6.2 81.24,15.07 v1(81.28,15.03) ; U7.2 81.91,32.6 v1(81.84,32.68)
  Bottom Layer w0.254: v1(81.84,32.68) 81.28,32.12 v1(81.28,15.03)
$5N874: length 32.1
  Top Layer w0.254: U7.4 v1(75.06,30.92) ; v1(75.06,14.01) 77.02,14.01 LED5.2 ; LED8.1 LED7.2 LED6.1 80.08,14.01 77.34,14.01
  Bottom Layer w0.254: v1(75.06,30.92) v1(75.06,14.01)
$5N878: length 24.5
  Top Layer w0.254: v1(80.65,32.68) U7.3 ; v1(80.26,16.8) 80.91,16.8 81.33,16.38 81.84,16.38 83.15,15.07 LED8.2
  Bottom Layer w0.254: v1(80.26,16.8) 80.65,17.18 v1(80.65,32.68)
$5N880: length 1.9
  Top Layer w0.254: C25.1 85.4,32.36 R13.2
$6N852: length 9.7
  Top Layer w0.254: C33.2 50.96,86.2 49.85,85.09 ; C33.2 52.78,90.09 C34.2 ; C33.2 49.57,91.48 L3.2
$6N853: length 10.8
  Top Layer w0.152: L3.1 48.84,90.45 L2.1
  Top Layer w0.254: 49.35,85.09 49.43,85.17 49.43,86.05 49.91,86.53 49.91,89.56 48.53,90.93 48.53,91.14 48.19,91.48 L3.1
$6N856: length 2.1
  Top Layer w0.254: C35.2 46.04,87.42 L5.2
$6N857: length 3.8
  Top Layer w0.152: L2.2 48.85,87.37 48.85,85.09
  Top Layer w0.254: L2.2 48.81,87.35 L5.1
$6N868: length 5.8
  Top Layer w0.152: R15.1 42.28,84.88 46.35,84.88 46.85,84.38 46.85,84.09
$6N870: length 3.9
  Top Layer w0.152: 46.85,82.59 46.1,82.59 45.53,82.02 45.53,79.67

## Copper pours and planes (outline as drawn; the poured copper is in the pictures)
3V3 on Top Layer: 53.72,39.41 55.63,39.41 55.63,35.35 53.72,35.35
3V3 on Top Layer: 20.73,36.7 21.53,36.7 21.53,34.12 20.73,34.12
3V3 on Top Layer: 63.37,45.51 66.17,45.51 66.17,37.41 63.37,37.41
3V3 on Top Layer: 17.39,36.49 18.61,36.49 18.61,33.82 17.39,33.82
3V3 on Top Layer: 63.37,39.16 77.22,39.16 77.22,37.41 63.37,37.41
3V3 on Top Layer: 17.4,34.6 21.53,34.6 21.53,33.82 17.4,33.82
3V3 on Top Layer: 74.17,42.84 77.6,42.84 77.6,33.44 74.17,33.44
3V3 on Top Layer: 63.37,86.53 72.39,86.53 72.39,84.24 63.37,84.24
3V3 on Top Layer: 42.04,45.38 56.54,45.38 56.54,43.35 42.04,43.35
3V3 on Top Layer: 44.45,84.43 46.23,84.43 46.23,83.1 44.45,83.1
3V3 on Top Layer: 44.45,76.75 46.4,76.75 46.4,74.21 44.45,74.21
3V3 on Top Layer: 42.14,36.76 55.63,36.76 55.63,35.46 42.14,35.46
3V3 on Top Layer: 53.72,39.41 66.17,39.41 66.17,37.41 53.72,37.41
3V3 on Top Layer: 63.37,92.11 66.17,92.11 66.17,43.21 63.37,43.21
3V3 on Top Layer: 5.46,40.04 9.4,40.04 9.4,23.79 5.46,23.79
3V3 on Bottom Layer: 11.18,76.37 28.04,76.37 28.04,74.08 11.18,74.08
3V3 on Bottom Layer: 44.45,86.15 46.35,86.15 46.35,74.21 44.45,74.21
3V3 on Bottom Layer: 10.67,75.48 13.08,75.48 13.08,36.62 10.67,36.62
3V3 on Bottom Layer: 5.46,40.68 13.08,40.68 13.08,36.62 5.46,36.62
3V3 on Bottom Layer: 6.86,35.07 18.61,35.07 18.61,34.08 6.86,34.08
3V3 on Bottom Layer: 54.4,45.53 66.17,45.53 66.17,43.35 54.4,43.35
3V3 on Bottom Layer: 24.38,77 66.17,77 66.17,74.21 24.38,74.21
3V3A on Top Layer: 74.18,52.51 77.29,52.51 77.29,43.09 74.18,43.09
3V3A on Top Layer: 14.22,64.05 16.89,64.05 16.89,59.73 14.22,59.73
3V3A on Top Layer: 27.41,66.46 29.84,66.46 29.84,58.84 27.41,58.84
3V3A on Bottom Layer: 27.43,66.46 77.29,66.46 77.29,63.29 27.43,63.29
3V3A on Bottom Layer: 74.04,66.46 77.16,66.46 77.16,49.62 74.04,49.62
+5V on Top Layer: 82.68,26.46 84.58,26.46 84.58,24.55 82.68,24.55
+5V on Top Layer: 77.85,36.87 84.3,36.87 84.3,35.65 77.85,35.65
+5V on Bottom Layer: 82.3,36.87 84.33,36.87 84.33,24.55 82.3,24.55
GND on Top Layer: 0,97.58 102.11,97.58 102.11,-5.29 0,-5.29
GND on Bottom Layer: 0,97.58 101.85,97.58 101.85,-5.29 0,-5.29
VBAT on Top Layer: 81.51,18.63 92.2,18.63 92.2,16.8 81.51,16.8
VBAT on Top Layer: 88.37,20.61 92.2,20.61 92.2,16.8 88.37,16.8
VCC on Top Layer: 91.82,36.49 93.34,36.49 93.34,30.01 91.82,30.01
AT1 on Top Layer: 53.87,96.09 56.17,96.09 56.17,95.59 53.87,95.59
AT1 on Top Layer: 49.77,96.09 52.17,96.09 52.17,95.59 49.77,95.59
AT1 on Top Layer: 43.87,96.09 48.07,96.09 48.07,95.59 43.87,95.59
AT1 on Top Layer: 45.57,95.82 46.07,95.82 46.07,90.49 45.57,90.49
AT1 on Top Layer: 47.57,95.77 48.07,95.77 48.07,92.95 47.57,92.95
AT1 on Top Layer: 47.66,93.45 50.2,93.45 50.2,92.95 47.66,92.95
AT1 on Top Layer: 55.67,95.77 56.17,95.77 56.17,91.65 55.67,91.65
AT1 on Top Layer: 51.67,95.77 52.17,95.77 52.17,92.95 51.67,92.95
AT1 on Top Layer: 53.87,95.77 54.37,95.77 54.37,92.95 53.87,92.95
AT1 on Top Layer: 43.87,95.8 44.77,95.8 44.77,90.49 43.87,90.49
AT1 on Top Layer: 51.68,93.45 54.17,93.45 54.17,92.95 51.68,92.95
AT1 on Top Layer: 49.77,95.77 50.27,95.77 50.27,92.95 49.77,92.95

Small or netless copper shapes (teardrops, artwork), in the pictures only: 268 on Top Layer, 90 on Bottom Layer

## Text on the board
Top Silkscreen Layer: Triple-J
